# Altium schematic sheet RPL_POWER_12V.SchDoc: Step-Down Switching Regulater +42VDC to +12VDC , 5A
size A; Date: Dec 17 2017; DrawnBy: Seyed Omid Hasanli; Revision: 1; SheetNumber: 2; Rule: PcbType=ProtelPcb
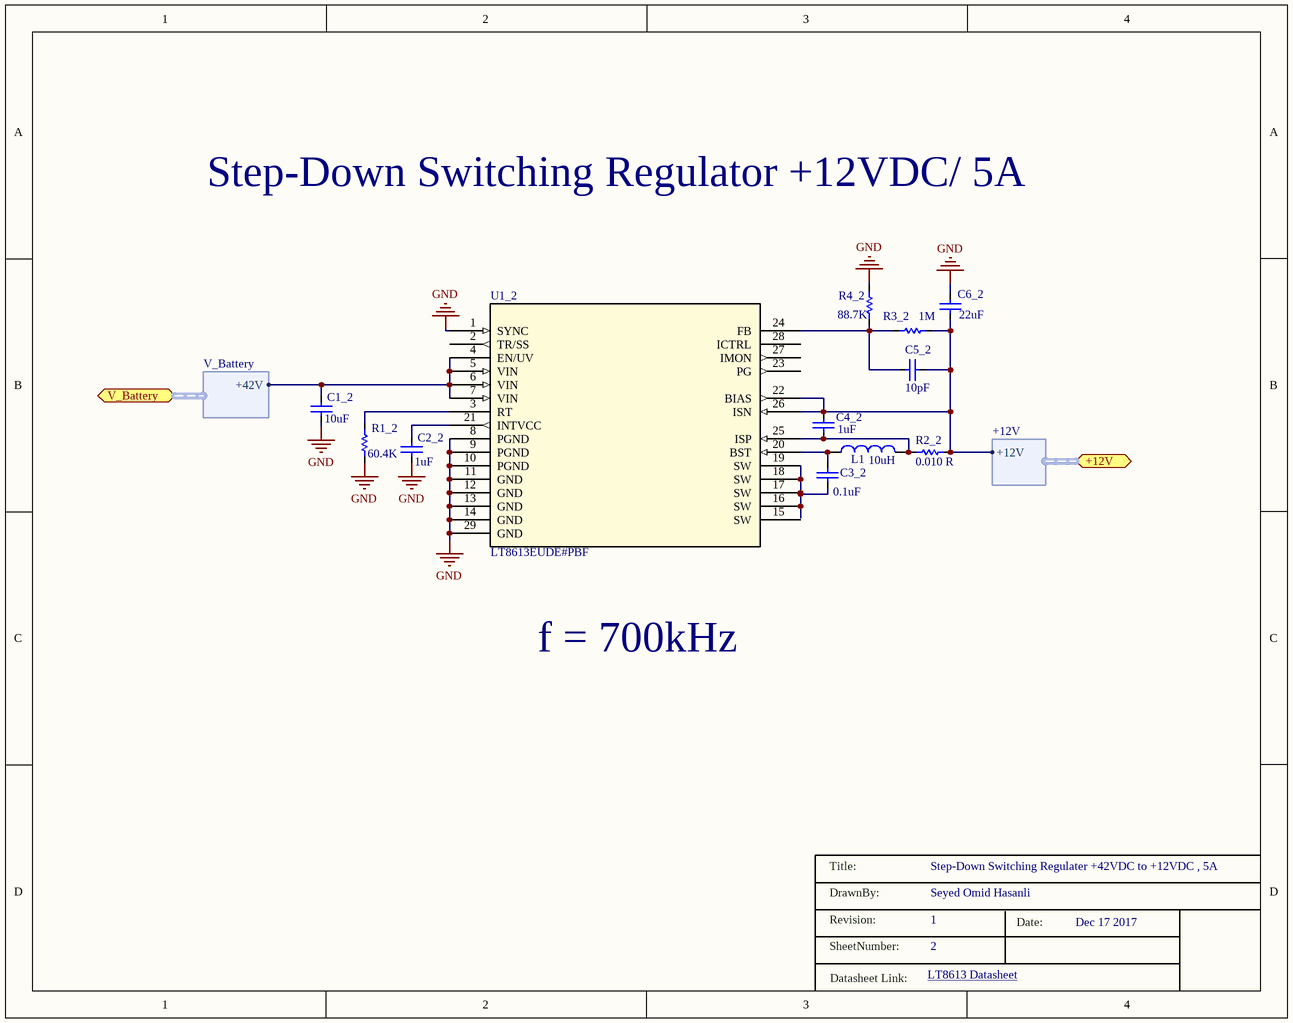
[diagram p0: RPL_POWER_12V.SchDoc]

## Parts
C1_2  value 10uF  [C0805C475K9RACAUTO]  (hidden comment: Cap)
C2_2  value 1uF  [C0805C475K9RACAUTO]  (hidden comment: Cap)
C3_2  value 0.1uF  [C0805C475K9RACAUTO]  (hidden comment: Cap)
C4_2  value 1uF  [C0805C475K9RACAUTO]  (hidden comment: Cap)
C5_2  value 10pF  [C0805C475K9RACAUTO]  (hidden comment: Cap)
C6_2  value 22uF  [C0805C475K9RACAUTO]  (hidden comment: Cap)
L1  value 10uH  [XAL6060-103MEB]  (hidden comment: COILCRAFT XAL6060)
R1_2  value 60.4K  [RES 0805]  (hidden comment: Res)
R2_2  value 0.010 R  [RES 1206]  (hidden comment: Res)
R3_2  value 1M  [RES 0805]  (hidden comment: Res)
R4_2  value 88.7K  [RES 0805]  (hidden comment: Res)
U1_2  LT8613EUDE#PBF  [QFN-28_UDE-L]

## Ports
+12V (harness +12V), V_Battery (harness V_Battery)

## Harnesses
+12V: +12V
V_Battery: +42V

## Nets
GND: C1_2.1 C2_2.1 C6_2.2 R1_2.1 R4_2.2 U1_2.1(SYNC) U1_2.8(PGND) U1_2.9(PGND) U1_2.10(PGND) U1_2.11(GND) U1_2.12(GND) U1_2.13(GND) U1_2.14(GND) U1_2.29(GND)
NetC1_2_2: C1_2.2 U1_2.4(EN/UV) U1_2.5(VIN) U1_2.6(VIN) U1_2.7(VIN) ; port V_Battery.+42V
NetC2_2_2: C2_2.2 U1_2.21(INTVCC)
NetC3_2_1: C3_2.1 U1_2.16(SW) U1_2.17(SW) U1_2.18(SW) U1_2.19(SW)
NetC3_2_2: C3_2.2 L1.1 U1_2.20(BST)
NetC4_2_1: C4_2.1 C5_2.1 C6_2.1 R2_2.2 R3_2.2 U1_2.22(BIAS) U1_2.26(ISN) ; port +12V.+12V
NetC4_2_2: C4_2.2 L1.2 R2_2.1 U1_2.25(ISP)
NetC5_2_2: C5_2.2 R3_2.1 R4_2.1 U1_2.24(FB)
NetR1_2_2: R1_2.2 U1_2.3(RT)

Not connected (* = marked no-connect by the designer): U1_2 2(TR/SS) 15(SW) 23(PG) 27(IMON) 28(ICTRL)

## Notes on the sheet
- Step-Down Switching Regulator +12VDC/ 5A
- f = 700kHz
- LT8613 Datasheet <http://cds.linear.com/docs/en/datasheet/8613f.pdf>
- Title:
- DrawnBy:
- Revision:
- SheetNumber:
- Date:
- Datasheet Link:

## Library data of the parts
L1 = Inductor: Link: https://www.mouser.com/productdetail/coilcraft/xal6060-103meb?qs=sGAEpiMZZMsg%252by3WlYCkU2kWFds1hA9Dj%252boRsAMLw7I%3D
U1_2 = LT8613EUDE#PBF: Imported; Vendor: Linear Technology; Manufacturer_Part_Number: lt8613eude#pbf; Value: Value; Type: Type; RefDes: RefDes